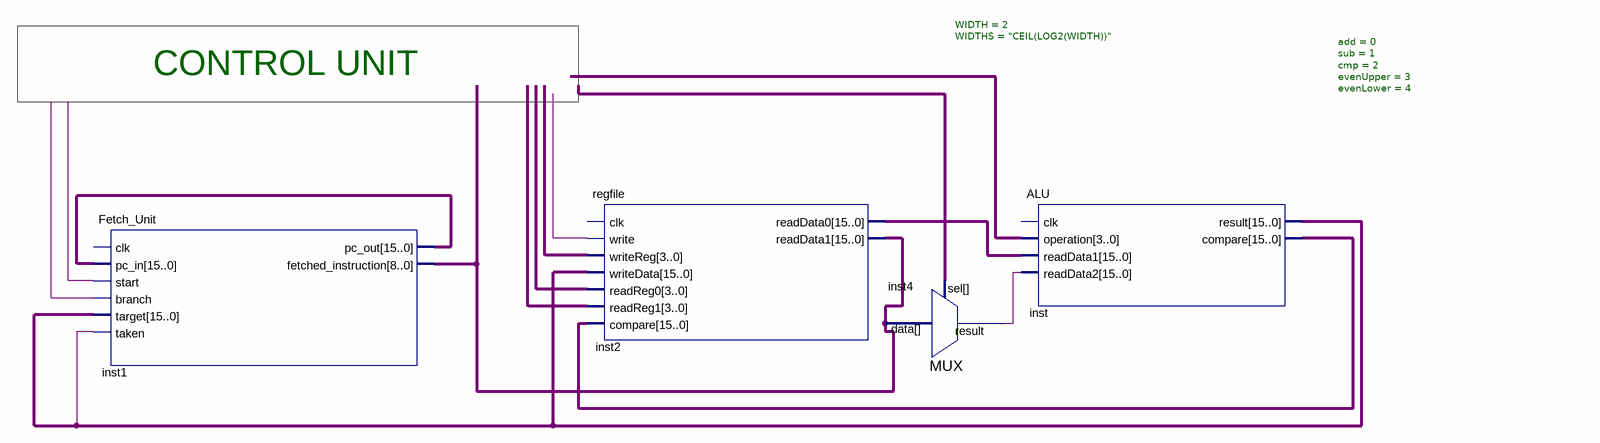
[diagram p0: schematic sheet]
// Quartus schematic top-level.bdf as structural Verilog: 4 symbols, 0 pins
module \top-level  (
);

  wire inst4_result, undriven, undriven_2, undriven_3, undriven_4, undriven_8;
  wire [3:0] undriven_5, undriven_6, undriven_7, undriven_9;
  wire [15:0] inst1_fetched_instruction, inst1_pc_out, inst2_readdata0, inst_compare, inst_result;

  Fetch_Unit inst1 (
    .pc_in(inst1_pc_out), .start(undriven), .branch(undriven_2), .target(inst_result), .taken(undriven_3),
    .pc_out(inst1_pc_out), .fetched_instruction(inst1_fetched_instruction));  // open: clk
  regfile inst2 (
    .write(undriven_4), .writeReg(undriven_5), .writeData(inst_result), .readReg0(undriven_6),
    .readReg1(undriven_7), .compare(inst_compare), .readData0(inst2_readdata0),
    .readData1(inst1_fetched_instruction));  // open: clk
  MUX #(.WIDTH(2), .WIDTHS("CEIL(LOG2(WIDTH))")) inst4 (
    .data(inst1_fetched_instruction), .sel(undriven_8), .result(inst4_result));
  ALU #(.add(0), .sub(1), .cmp(2), .evenUpper(3), .evenLower(4)) inst (
    .operation(undriven_9), .readData1(inst2_readdata0), .readData2({16{inst4_result}}),
    .result(inst_result), .compare(inst_compare));  // open: clk

  // Notes on the sheet:
  //   CONTROL UNIT
endmodule
